# Altium project KSS.PrjPcb
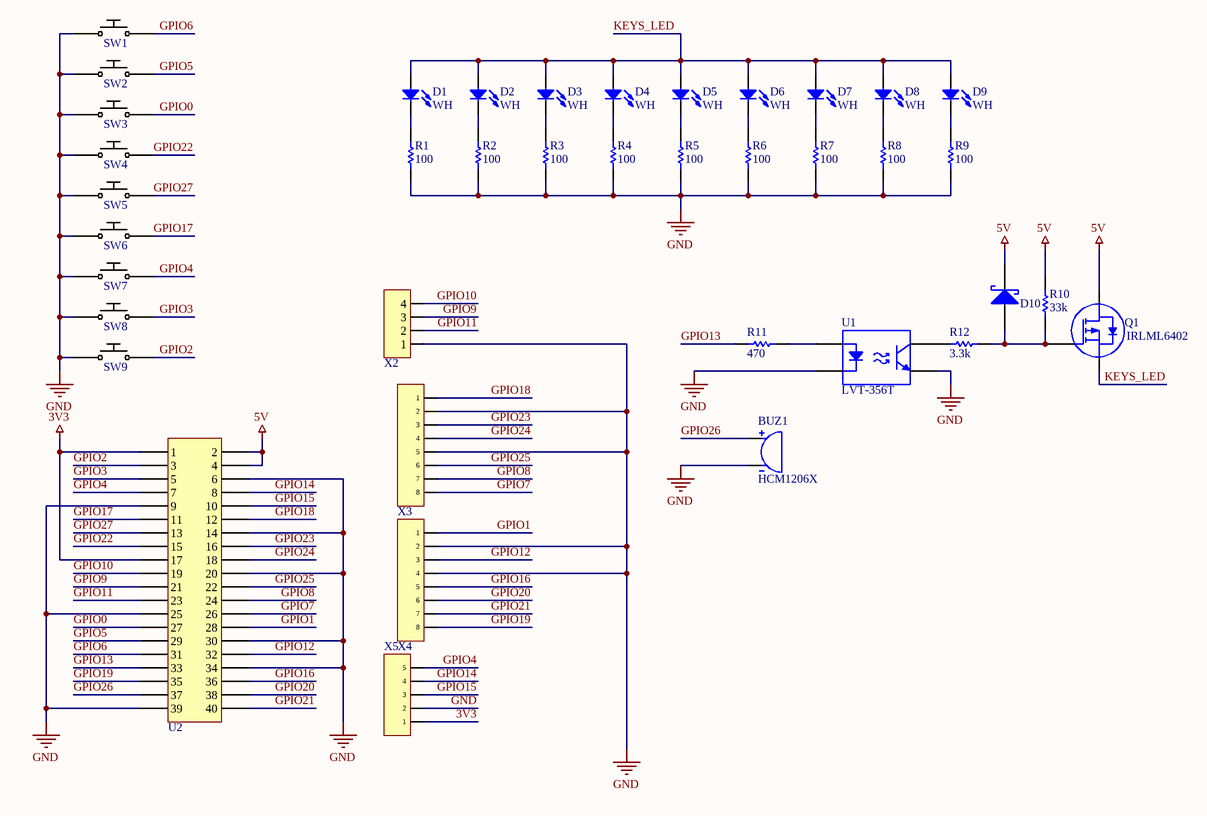
[diagram p0: KSS_4_button.SchDoc]
1 sheet, 39 parts. Net scope: global (net labels, ports and power ports of the same name join across sheets).
Board file: KSS_4_button.PcbDoc

## Sheet KSS_4_button.SchDoc
size A4; SheetNumber: 1; SheetTotal: 1

### Parts
BUZ1  HCM1206X  [HCM1206X]
D1  WH  [LED_1206/3mm]
D2  WH  [LED_1206/3mm]
D3  WH  [LED_1206/3mm]
D4  WH  [LED_1206/3mm]
D5  WH  [LED_1206/3mm]
D6  WH  [LED_1206/3mm]
D7  WH  [LED_1206/3mm]
D8  WH  [LED_1206/3mm]
D9  WH  [LED_1206/3mm]
D10  SS14  [SMA/DO-214AC]  (value not drawn)
Q1  IRLML6402  [SOT23_3_PIN]
R1  Resistance: 100  [RES_0603]  (hidden comment: Resistor)
R2  Resistance: 100  [RES_0603]  (hidden comment: Resistor)
R3  Resistance: 100  [RES_0603]  (hidden comment: Resistor)
R4  Resistance: 100  [RES_0603]  (hidden comment: Resistor)
R5  Resistance: 100  [RES_0603]  (hidden comment: Resistor)
R6  Resistance: 100  [RES_0603]  (hidden comment: Resistor)
R7  Resistance: 100  [RES_0603]  (hidden comment: Resistor)
R8  Resistance: 100  [RES_0603]  (hidden comment: Resistor)
R9  Resistance: 100  [RES_0603]  (hidden comment: Resistor)
R10  Resistance: 33k  [RES_0603]  (hidden comment: Resistor)
R11  Resistance: 470  [RES_0603]  (hidden comment: Resistor)
R12  Resistance: 3.3k  [RES_0603]  (hidden comment: Resistor)
SW1  Pushbutton  [Key switch Outemu]  (value not drawn)
SW2  Pushbutton  [Key switch Outemu]  (value not drawn)
SW3  Pushbutton  [Key switch Outemu]  (value not drawn)
SW4  Pushbutton  [Key switch Outemu]  (value not drawn)
SW5  Pushbutton  [Key switch Outemu]  (value not drawn)
SW6  Pushbutton  [Key switch Outemu]  (value not drawn)
SW7  Pushbutton  [Key switch Outemu]  (value not drawn)
SW8  Pushbutton  [Key switch Outemu]  (value not drawn)
SW9  Pushbutton  [Key switch Outemu]  (value not drawn)
U1  LVT-356T  [SOP-4]
U2  RASPBERRY_PI_ZERO_W2  [RASPBERRY_PI_ZERO_W2]  (value not drawn)
X2  Connector_x4  [GROVE_4_pin_2mm_socket]  (value not drawn)
X3  HEADER_X8  [HEADER_1X8_F]  (value not drawn)
X4  HEADER_X8  [HEADER_1X8_F]  (value not drawn)
X5  GPS  [HEADER_1X5_F]  (value not drawn)

### Nets
3V3: U2.1 U2.17 X5.1
5V: D10.2(K) Q1.3(D) R10.1 U2.2 U2.4
GND: BUZ1.2(-) R1.1 R2.1 R3.1 R4.1 R5.1 R6.1 R7.1 R8.1 R9.1 SW1.1 SW2.1 SW3.1 SW4.1 SW5.1 SW6.1 SW7.1 SW8.1 SW9.1 U1.2(K) U1.3(E) U2.6 U2.9 U2.14 U2.20 U2.25 U2.30 U2.34 U2.39 X2.1 X3.2 X3.5 X4.2 X4.4 X5.2
GPIO0: SW3.2 U2.27
GPIO1: U2.28 X4.1
GPIO2: SW9.2 U2.3
GPIO3: SW8.2 U2.5
GPIO4: SW7.2 U2.7 X5.5
GPIO5: SW2.2 U2.29
GPIO6: SW1.2 U2.31
GPIO7: U2.26 X3.8
GPIO8: U2.24 X3.7
GPIO9: U2.21 X2.3
GPIO10: U2.19 X2.4
GPIO11: U2.23 X2.2
GPIO12: U2.32 X4.3
GPIO13: R11.1 U2.33
GPIO14: U2.8 X5.4
GPIO15: U2.10 X5.3
GPIO16: U2.36 X4.5
GPIO17: SW6.2 U2.11
GPIO18: U2.12 X3.1
GPIO19: U2.35 X4.8
GPIO20: U2.38 X4.6
GPIO21: U2.40 X4.7
GPIO22: SW4.2 U2.15
GPIO23: U2.16 X3.3
GPIO24: U2.18 X3.4
GPIO25: U2.22 X3.6
GPIO26: BUZ1.1(+) U2.37
GPIO27: SW5.2 U2.13
KEYS_LED: D1.1(A) D2.1(A) D3.1(A) D4.1(A) D5.1(A) D6.1(A) D7.1(A) D8.1(A) D9.1(A) Q1.2(S)
NetD1_2: D1.2(K) R1.2
NetD2_2: D2.2(K) R2.2
NetD3_2: D3.2(K) R3.2
NetD4_2: D4.2(K) R4.2
NetD5_2: D5.2(K) R5.2
NetD6_2: D6.2(K) R6.2
NetD7_2: D7.2(K) R7.2
NetD8_2: D8.2(K) R8.2
NetD9_2: D9.2(K) R9.2
NetD10_1: D10.1(A) Q1.1(G) R10.2 R12.2
NetR11_2: R11.2 U1.1(A)
NetR12_1: R12.1 U1.4(C)

### Library data of the parts
BUZ1 = HCM1206X: Buzzer; V: 3V; f: 3000 Hz
D1-D9 = Diode LED
D10 = SS14: Schottky; VRRM: 40 V; VRMS: 28V; I(AV): 1 A; IFSM: 30 A; IR; TA=25: 0.5 mA; IR; TA=100: 20 mA; VF: 0.7V
Q1 = IRLML6402: P-MOSFET; VDSS: -20 V; IDmax: -3.7A; RDSon: 0.065 Ohm; VGS: 12 V
U1 = LVT-356T: Optocoupler; Parameter 1: *
X5 = HEADER_X5